# Altium schematic sheet Display.SchDoc: ZStation Display
size A4; Engineer: Stephan Eersels; DocumentNumber: 12202925_ZS; Revision: 2.1; SheetNumber: 7; SheetTotal: 8